# Altium schematic sheet TopLevel.SchDoc
size 508 x 304 mm; SheetNumber: 1; SheetTotal: 11
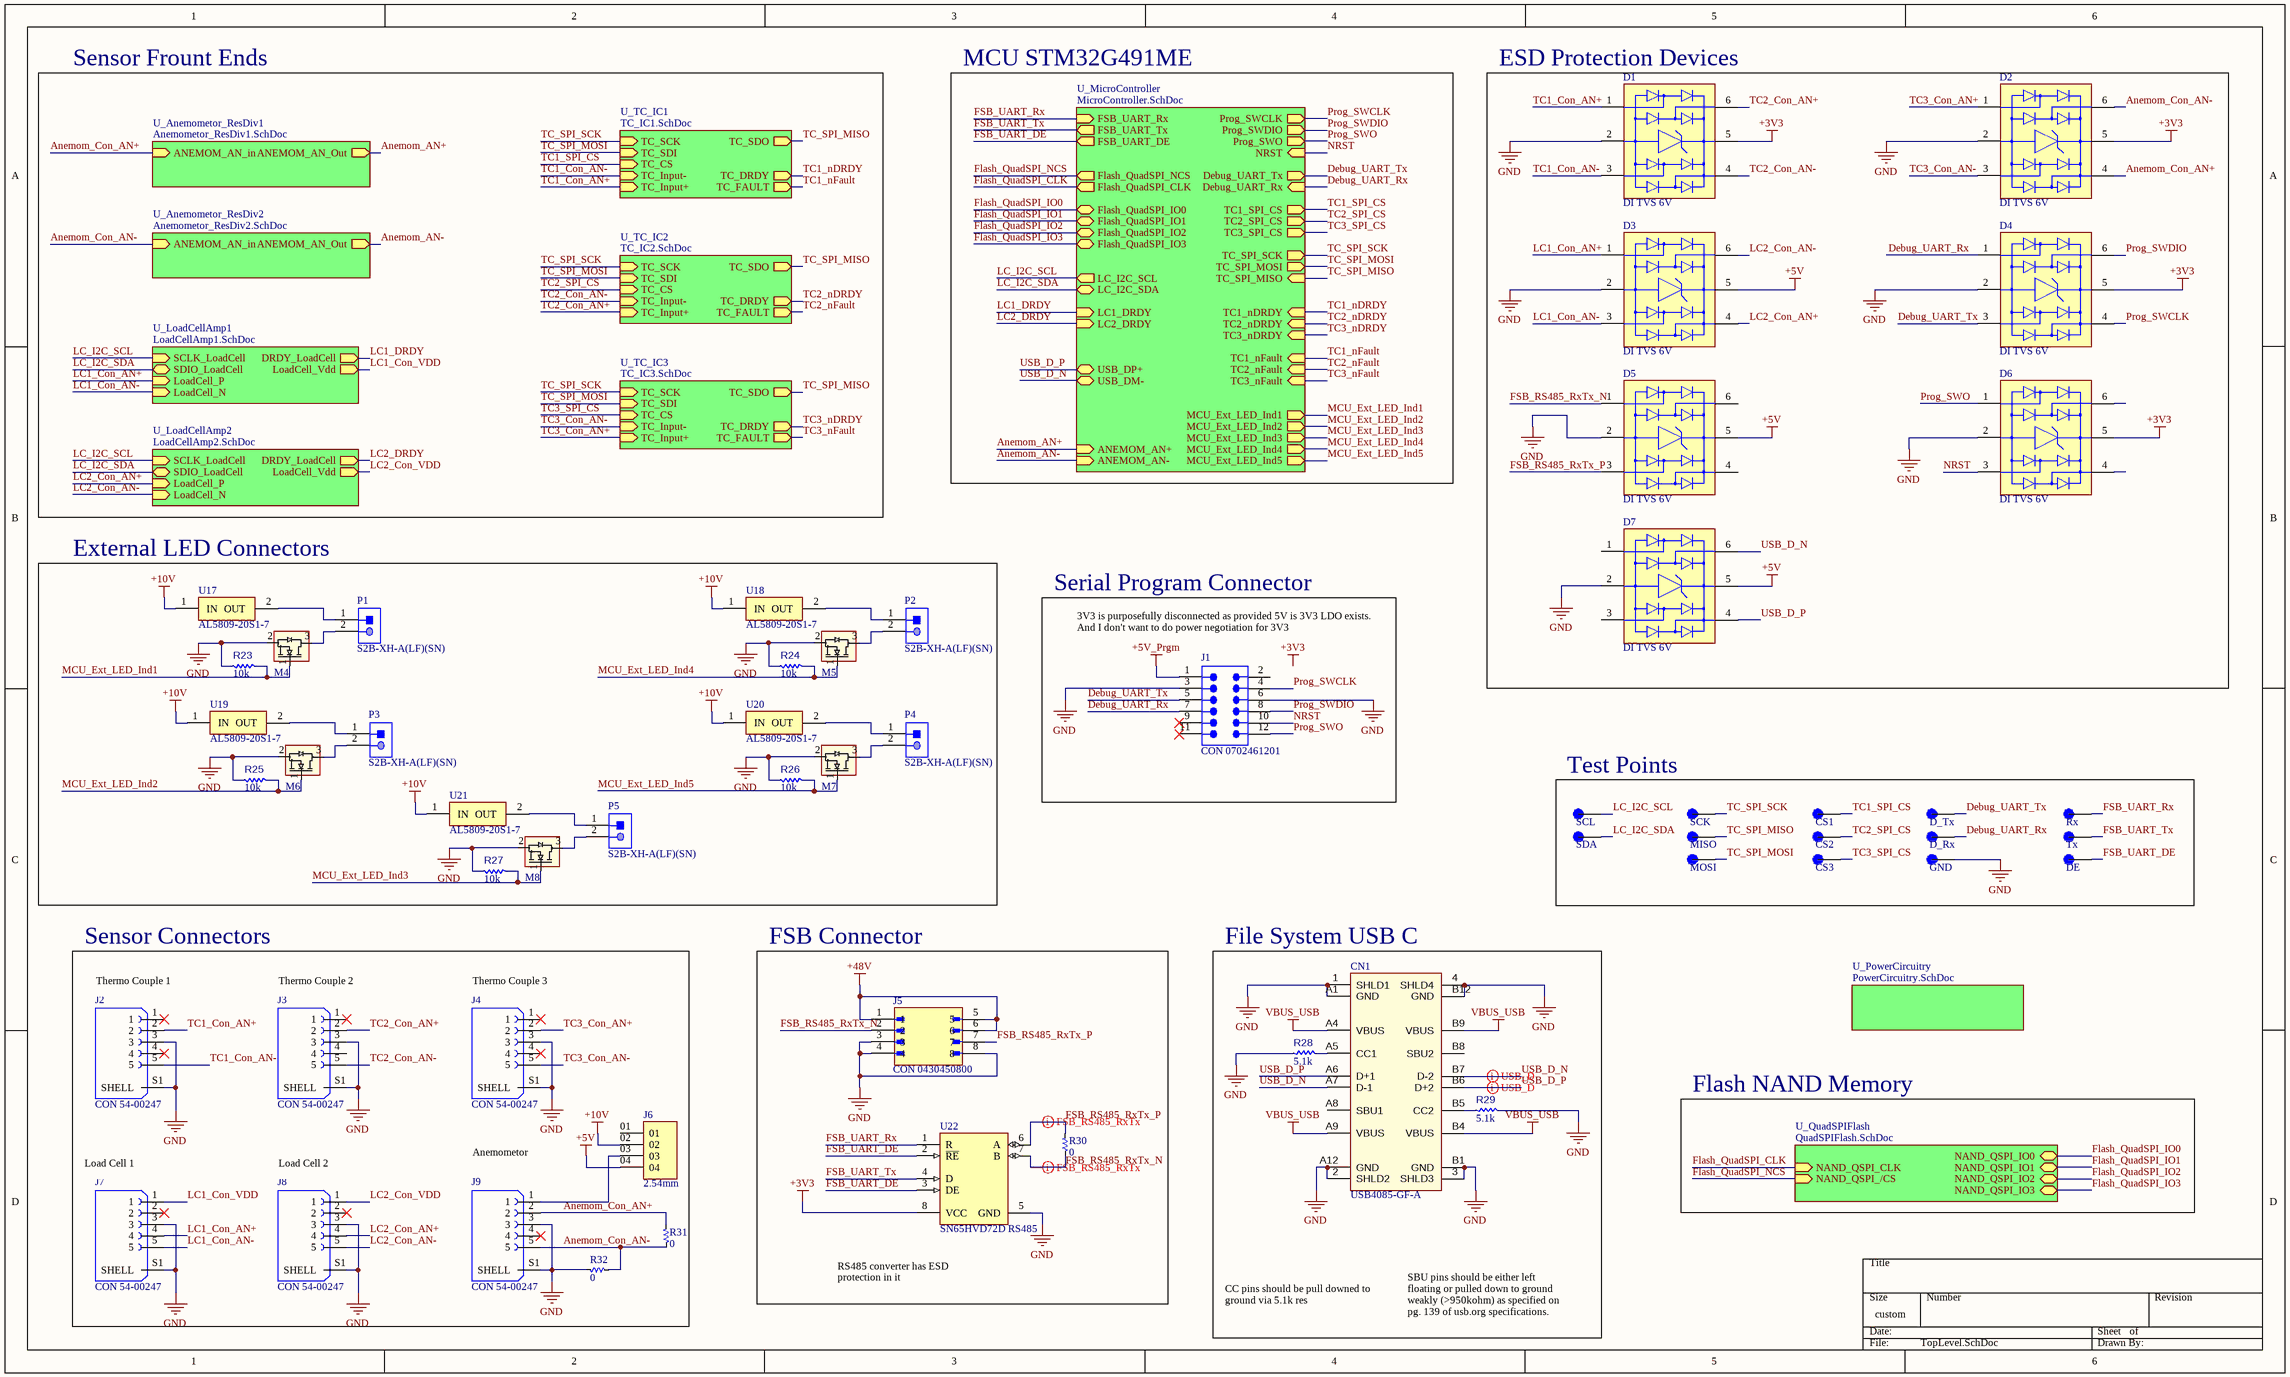
[diagram p0: TopLevel.SchDoc]

## Parts
CN1  USB4085-GF-A  [FP-USB4085-GF-A-MFG]
CS1  TP Clip 1206  RCWCTE  [1206 TP Clip RCWCTE-Footprint-1]  (value not drawn)
CS2  TP Clip 1206  RCWCTE  [1206 TP Clip RCWCTE-Footprint-1]  (value not drawn)
CS3  TP Clip 1206  RCWCTE  [1206 TP Clip RCWCTE-Footprint-1]  (value not drawn)
D1  DI TVS 6V  [FP-SOT363-IPC_C]
D2  DI TVS 6V  [FP-SOT363-IPC_C]
D3  DI TVS 6V  [FP-SOT363-IPC_C]
D4  DI TVS 6V  [FP-SOT363-IPC_C]
D5  DI TVS 6V  [FP-SOT363-IPC_C]
D6  DI TVS 6V  [FP-SOT363-IPC_C]
D7  DI TVS 6V  [FP-SOT363-IPC_C]
D_Rx  TP Clip 1206  RCWCTE  [1206 TP Clip RCWCTE-Footprint-1]  (value not drawn)
D_Tx  TP Clip 1206  RCWCTE  [1206 TP Clip RCWCTE-Footprint-1]  (value not drawn)
DE  TP Clip 1206  RCWCTE  [1206 TP Clip RCWCTE-Footprint-1]  (value not drawn)
GND  TP Clip 1206  RCWCTE  [1206 TP Clip RCWCTE-Footprint-1]  (value not drawn)
J1  CON 0702461201  [FP-70246-1201-0]
J2  CON 54-00247  [CON 54-00247-Footprint-1]
J3  CON 54-00247  [CON 54-00247-Footprint-1]
J4  CON 54-00247  [CON 54-00247-Footprint-1]
J5  CON 0430450800  [CON 0430450800-Footprint-1]
J6  2.54mm  [HEADER 4pos 2.54mm-Footprint-1]
J7  CON 54-00247  [CON 54-00247-Footprint-1]
J8  CON 54-00247  [CON 54-00247-Footprint-1]
J9  CON 54-00247  [CON 54-00247-Footprint-1]
M4  MOS NMOS 30V 5.6A SOT-23  [PJA3404_R1_00001-Footprint-1]  (value not drawn)
M5  MOS NMOS 30V 5.6A SOT-23  [PJA3404_R1_00001-Footprint-1]  (value not drawn)
M6  MOS NMOS 30V 5.6A SOT-23  [PJA3404_R1_00001-Footprint-1]  (value not drawn)
M7  MOS NMOS 30V 5.6A SOT-23  [PJA3404_R1_00001-Footprint-1]  (value not drawn)
M8  MOS NMOS 30V 5.6A SOT-23  [PJA3404_R1_00001-Footprint-1]  (value not drawn)
MISO  TP Clip 1206  RCWCTE  [1206 TP Clip RCWCTE-Footprint-1]  (value not drawn)
MOSI  TP Clip 1206  RCWCTE  [1206 TP Clip RCWCTE-Footprint-1]  (value not drawn)
P1  S2B-XH-A(LF)(SN)  [JST-S2B-XH-A(LF)(SN)_V]
P2  S2B-XH-A(LF)(SN)  [JST-S2B-XH-A(LF)(SN)_V]
P3  S2B-XH-A(LF)(SN)  [JST-S2B-XH-A(LF)(SN)_V]
P4  S2B-XH-A(LF)(SN)  [JST-S2B-XH-A(LF)(SN)_V]
P5  S2B-XH-A(LF)(SN)  [JST-S2B-XH-A(LF)(SN)_V]
R23  value 10k  [RESC2013X50X35ML15T15]  (hidden comment: Resistor 10k +/-1% 0805 125 mW)
R24  value 10k  [RESC2013X50X35ML15T15]  (hidden comment: Resistor 10k +/-1% 0805 125 mW)
R25  value 10k  [RESC2013X50X35ML15T15]  (hidden comment: Resistor 10k +/-1% 0805 125 mW)
R26  value 10k  [RESC2013X50X35ML15T15]  (hidden comment: Resistor 10k +/-1% 0805 125 mW)
R27  value 10k  [RESC2013X50X35ML15T15]  (hidden comment: Resistor 10k +/-1% 0805 125 mW)
R28  value 5.1k  [RESC1608X55X25ML10T15]  (hidden comment: RC0603FR-075K1L)
R29  value 5.1k  [RESC1608X55X25ML10T15]  (hidden comment: RC0603FR-075K1L)
R30  value 0  [0603]  (hidden comment: RT-0R00-F-1/10W-0603)
R31  value 0  [0603]  (hidden comment: RT-0R00-F-1/10W-0603)
R32  value 0  [0603]  (hidden comment: RT-0R00-F-1/10W-0603)
Rx  TP Clip 1206  RCWCTE  [1206 TP Clip RCWCTE-Footprint-1]  (value not drawn)
SCK  TP Clip 1206  RCWCTE  [1206 TP Clip RCWCTE-Footprint-1]  (value not drawn)
SCL  TP Clip 1206  RCWCTE  [1206 TP Clip RCWCTE-Footprint-1]  (value not drawn)
SDA  TP Clip 1206  RCWCTE  [1206 TP Clip RCWCTE-Footprint-1]  (value not drawn)
Tx  TP Clip 1206  RCWCTE  [1206 TP Clip RCWCTE-Footprint-1]  (value not drawn)
U17  AL5809-20S1-7  [DIOD-SOD123-A_V]
U18  AL5809-20S1-7  [DIOD-SOD123-A_V]
U19  AL5809-20S1-7  [DIOD-SOD123-A_V]
U20  AL5809-20S1-7  [DIOD-SOD123-A_V]
U21  AL5809-20S1-7  [DIOD-SOD123-A_V]
U22  SN65HVD72D RS485  [D0008A_L]

## Blocks framed on the sheet
ESD Protection Devices: D1-D7
External LED Connectors: M4-M8 P1-P5 R23-R27 U17-U21
Serial Program Connector: J1
Test Points: CS1-CS3 D_Rx D_Tx DE GND MISO MOSI Rx SCK SCL SDA Tx
Sensor Connectors: J2-J4 J6-J9 R31 R32
FSB Connector: J5 R30 U22
File System USB C: CN1 R28 R29

## Sub-sheets
U_Anemometor_ResDiv1 = Anemometor_ResDiv1.SchDoc: ANEMOM_AN_in (in), ANEMOM_AN_Out (out)
U_Anemometor_ResDiv2 = Anemometor_ResDiv2.SchDoc: ANEMOM_AN_in (in), ANEMOM_AN_Out (out)
U_LoadCellAmp1 = LoadCellAmp1.SchDoc: DRDY_LoadCell (out), SCLK_LoadCell (in), SDIO_LoadCell (bidir), LoadCell_P (in), LoadCell_N (in), LoadCell_Vdd (out)
U_LoadCellAmp2 = LoadCellAmp2.SchDoc: DRDY_LoadCell (out), SCLK_LoadCell (in), SDIO_LoadCell (bidir), LoadCell_P (in), LoadCell_N (in), LoadCell_Vdd (out)
U_MicroController = MicroController.SchDoc: NRST (in), FSB_UART_Tx (out), FSB_UART_Rx (in), Prog_SWCLK (out), Prog_SWDIO (out), Prog_SWO (out), FSB_UART_DE (out), Debug_UART_Tx (out), Debug_UART_Rx (in), Flash_QuadSPI_CLK (out), Flash_QuadSPI_NCS (out), Flash_QuadSPI_IO2 (bidir), Flash_QuadSPI_IO3 (bidir), Flash_QuadSPI_IO1 (bidir), Flash_QuadSPI_IO0 (bidir), TC_SPI_SCK (out), TC_SPI_MISO (in), TC_SPI_MOSI (out), TC1_SPI_CS (out), TC2_SPI_CS (out), TC3_SPI_CS (out), LC_I2C_SCL (out), LC_I2C_SDA (bidir), USB_DP+ (bidir), USB_DM- (bidir), ANEMOM_AN+ (in), ANEMOM_AN- (in), MCU_Ext_LED_Ind1 (out), MCU_Ext_LED_Ind2 (out), MCU_Ext_LED_Ind3 (out), MCU_Ext_LED_Ind4 (out), MCU_Ext_LED_Ind5 (out), TC3_nDRDY (in), TC2_nDRDY (in), TC1_nDRDY (in), TC3_nFault (in), TC2_nFault (in), TC1_nFault (in), LC1_DRDY (in), LC2_DRDY (in)
U_PowerCircuitry = PowerCircuitry.SchDoc: no entries
U_QuadSPIFlash = QuadSPIFlash.SchDoc: NAND_QSPI_/CS (in), NAND_QSPI_IO1 (bidir), NAND_QSPI_IO2 (bidir), NAND_QSPI_IO3 (bidir), NAND_QSPI_CLK (in), NAND_QSPI_IO0 (bidir)
U_TC_IC1 = TC_IC1.SchDoc: TC_SCK (in), TC_SDI (in), TC_SDO (out), TC_CS (in), TC_Input- (in), TC_Input+ (in), TC_DRDY (out), TC_FAULT (out)
U_TC_IC2 = TC_IC2.SchDoc: TC_SCK (in), TC_SDI (in), TC_SDO (out), TC_CS (in), TC_Input- (in), TC_Input+ (in), TC_DRDY (out), TC_FAULT (out)
U_TC_IC3 = TC_IC3.SchDoc: TC_SCK (in), TC_SDI (in), TC_SDO (out), TC_CS (in), TC_Input- (in), TC_Input+ (in), TC_DRDY (out), TC_FAULT (out)

## Nets
+3V3: D1.5(VP) D2.5(VP) D4.5(VP) D6.5(VP) U22.8(VCC)
+5V: D3.5(VP) D5.5(VP) D7.5(VP) J6.04
+5V_Prgm: J1.1
+10V: J6.02 U17.1(IN) U18.1(IN) U19.1(IN) U20.1(IN) U21.1(IN)
+48V: J5.1 J5.5 J5.6
GND: CN1.1(SHLD1) CN1.2(SHLD2) CN1.3(SHLD3) CN1.4(SHLD4) CN1.A1(GND) CN1.A12(GND) CN1.B1(GND) CN1.B12(GND) D1.2(VN) D2.2(VN) D3.2(VN) D4.2(VN) D5.2(VN) D6.2(VN) D7.2(VN) GND.1(TP) J1.3 J1.6 J2.3 J2.S1(SHELL) J3.3 J3.S1(SHELL) J4.3 J4.S1(SHELL) J5.3 J5.4 J5.8 J7.3 J7.S1(SHELL) J8.3 J8.S1(SHELL) J9.3 J9.S1(SHELL) M4.2 M5.2 M6.2 M7.2 M8.2 R23.2 R24.2 R25.2 R26.2 R27.2 R28.1 R29.2 R32.1 U22.5(GND)
VBUS_USB: CN1.A4(VBUS) CN1.A9(VBUS) CN1.B4(VBUS) CN1.B9(VBUS)
Anemom_AN+: sheet U_MicroController/ANEMOM_AN+, sheet U_Anemometor_ResDiv1/ANEMOM_AN_Out
Anemom_AN-: sheet U_MicroController/ANEMOM_AN-, sheet U_Anemometor_ResDiv2/ANEMOM_AN_Out
Anemom_Con_AN+: D2.4(CH3) J9.2 R31.2 ; sheet U_Anemometor_ResDiv1/ANEMOM_AN_in
Anemom_Con_AN-: D2.6(CH4) J9.5 R31.1 R32.2 ; sheet U_Anemometor_ResDiv2/ANEMOM_AN_in
Debug_UART_Rx: D4.1(CH1) D_Rx.1(TP) J1.7 ; sheet U_MicroController/Debug_UART_Rx
Debug_UART_Tx: D4.3(CH2) D_Tx.1(TP) J1.5 ; sheet U_MicroController/Debug_UART_Tx
Flash_QuadSPI_CLK: sheet U_MicroController/Flash_QuadSPI_CLK, sheet U_QuadSPIFlash/NAND_QSPI_CLK
Flash_QuadSPI_IO0: sheet U_MicroController/Flash_QuadSPI_IO0, sheet U_QuadSPIFlash/NAND_QSPI_IO0
Flash_QuadSPI_IO1: sheet U_MicroController/Flash_QuadSPI_IO1, sheet U_QuadSPIFlash/NAND_QSPI_IO1
Flash_QuadSPI_IO2: sheet U_MicroController/Flash_QuadSPI_IO2, sheet U_QuadSPIFlash/NAND_QSPI_IO2
Flash_QuadSPI_IO3: sheet U_MicroController/Flash_QuadSPI_IO3, sheet U_QuadSPIFlash/NAND_QSPI_IO3
Flash_QuadSPI_NCS: sheet U_MicroController/Flash_QuadSPI_NCS, sheet U_QuadSPIFlash/NAND_QSPI_/CS
FSB_RS485_RxTx_N: D5.1(CH1) J5.2 R30.1 U22.7(B)
FSB_RS485_RxTx_P: D5.3(CH2) J5.7 R30.2 U22.6(A)
FSB_UART_DE: DE.1(TP) U22.2(~{RE}) U22.3(DE) ; sheet U_MicroController/FSB_UART_DE
FSB_UART_Rx: Rx.1(TP) U22.1(R) ; sheet U_MicroController/FSB_UART_Rx
FSB_UART_Tx: Tx.1(TP) U22.4(D) ; sheet U_MicroController/FSB_UART_Tx
LC1_Con_AN+: D3.1(CH1) J7.4 ; sheet U_LoadCellAmp1/LoadCell_P
LC1_Con_AN-: D3.3(CH2) J7.5 ; sheet U_LoadCellAmp1/LoadCell_N
LC1_Con_VDD: J7.1 ; sheet U_LoadCellAmp1/LoadCell_Vdd
LC1_DRDY: sheet U_MicroController/LC1_DRDY, sheet U_LoadCellAmp1/DRDY_LoadCell
LC2_Con_AN+: D3.4(CH3) J8.4 ; sheet U_LoadCellAmp2/LoadCell_P
LC2_Con_AN-: D3.6(CH4) J8.5 ; sheet U_LoadCellAmp2/LoadCell_N
LC2_Con_VDD: J8.1 ; sheet U_LoadCellAmp2/LoadCell_Vdd
LC2_DRDY: sheet U_MicroController/LC2_DRDY, sheet U_LoadCellAmp2/DRDY_LoadCell
LC_I2C_SCL: SCL.1(TP) ; sheet U_MicroController/LC_I2C_SCL, sheet U_LoadCellAmp1/SCLK_LoadCell, sheet U_LoadCellAmp2/SCLK_LoadCell
LC_I2C_SDA: SDA.1(TP) ; sheet U_MicroController/LC_I2C_SDA, sheet U_LoadCellAmp1/SDIO_LoadCell, sheet U_LoadCellAmp2/SDIO_LoadCell
MCU_Ext_LED_Ind1: M4.1 R23.1 ; sheet U_MicroController/MCU_Ext_LED_Ind1
MCU_Ext_LED_Ind2: M6.1 R25.1 ; sheet U_MicroController/MCU_Ext_LED_Ind2
MCU_Ext_LED_Ind3: M8.1 R27.1 ; sheet U_MicroController/MCU_Ext_LED_Ind3
MCU_Ext_LED_Ind4: M5.1 R24.1 ; sheet U_MicroController/MCU_Ext_LED_Ind4
MCU_Ext_LED_Ind5: M7.1 R26.1 ; sheet U_MicroController/MCU_Ext_LED_Ind5
NRST: D6.3(CH2) J1.10 ; sheet U_MicroController/NRST
Prog_SWCLK: D4.4(CH3) J1.4 ; sheet U_MicroController/Prog_SWCLK
Prog_SWDIO: D4.6(CH4) J1.8 ; sheet U_MicroController/Prog_SWDIO
Prog_SWO: D6.1(CH1) J1.12 ; sheet U_MicroController/Prog_SWO
TC1_Con_AN+: D1.1(CH1) J2.2 ; sheet U_TC_IC1/TC_Input+
TC1_Con_AN-: D1.3(CH2) J2.5 ; sheet U_TC_IC1/TC_Input-
TC1_nDRDY: sheet U_MicroController/TC1_nDRDY, sheet U_TC_IC1/TC_DRDY
TC1_nFault: sheet U_MicroController/TC1_nFault, sheet U_TC_IC1/TC_FAULT
TC1_SPI_CS: CS1.1(TP) ; sheet U_MicroController/TC1_SPI_CS, sheet U_TC_IC1/TC_CS
TC2_Con_AN+: D1.6(CH4) J3.2 ; sheet U_TC_IC2/TC_Input+
TC2_Con_AN-: D1.4(CH3) J3.5 ; sheet U_TC_IC2/TC_Input-
TC2_nDRDY: sheet U_MicroController/TC2_nDRDY, sheet U_TC_IC2/TC_DRDY
TC2_nFault: sheet U_MicroController/TC2_nFault, sheet U_TC_IC2/TC_FAULT
TC2_SPI_CS: CS2.1(TP) ; sheet U_MicroController/TC2_SPI_CS, sheet U_TC_IC2/TC_CS
TC3_Con_AN+: D2.1(CH1) J4.2 ; sheet U_TC_IC3/TC_Input+
TC3_Con_AN-: D2.3(CH2) J4.5 ; sheet U_TC_IC3/TC_Input-
TC3_nDRDY: sheet U_MicroController/TC3_nDRDY, sheet U_TC_IC3/TC_DRDY
TC3_nFault: sheet U_MicroController/TC3_nFault, sheet U_TC_IC3/TC_FAULT
TC3_SPI_CS: CS3.1(TP) ; sheet U_MicroController/TC3_SPI_CS, sheet U_TC_IC3/TC_CS
TC_SPI_MISO: MISO.1(TP) ; sheet U_MicroController/TC_SPI_MISO, sheet U_TC_IC1/TC_SDO, sheet U_TC_IC2/TC_SDO, sheet U_TC_IC3/TC_SDO
TC_SPI_MOSI: MOSI.1(TP) ; sheet U_MicroController/TC_SPI_MOSI, sheet U_TC_IC1/TC_SDI, sheet U_TC_IC2/TC_SDI, sheet U_TC_IC3/TC_SDI
TC_SPI_SCK: SCK.1(TP) ; sheet U_MicroController/TC_SPI_SCK, sheet U_TC_IC1/TC_SCK, sheet U_TC_IC2/TC_SCK, sheet U_TC_IC3/TC_SCK
USB_D_N: CN1.A7(D-1) CN1.B7(D-2) D7.6(CH4) ; sheet U_MicroController/USB_DM-
USB_D_P: CN1.A6(D+1) CN1.B6(D+2) D7.4(CH3) ; sheet U_MicroController/USB_DP+
NetCN1_A5: CN1.A5(CC1) R28.2
NetCN1_B5: CN1.B5(CC2) R29.1
NetJ6_03: J6.03 J9.1
NetM4_3: M4.3 P1.2
NetM5_3: M5.3 P2.2
NetM6_3: M6.3 P3.2
NetM7_3: M7.3 P4.2
NetM8_3: M8.3 P5.2
NetP1_1: P1.1 U17.2(OUT)
NetP2_1: P2.1 U18.2(OUT)
NetP3_1: P3.1 U19.2(OUT)
NetP4_1: P4.1 U20.2(OUT)
NetP5_1: P5.1 U21.2(OUT)

Not connected (* = marked no-connect by the designer): CN1 A8(SBU1) B8(SBU2); D5 4(CH3) 6(CH4); D6 4(CH3) 6(CH4); D7 1(CH1) 3(CH2); J1 2 9* 11*; J2 1* 4*; J3 1* 4; J4 1* 4*; J6 01; J7 2*; J8 2*; J9 4*

## Layout directives
differential pair: FSB_RS485_RxTx_N, FSB_RS485_RxTx_P, USB_D_N, USB_D_P

## Notes on the sheet
- Sensor Frount Ends
- MCU STM32G491ME
- (near J1) 3V3 is purposefully disconnected as provided 5V is 3V3 LDO exists. And I don't want to do power negotiation for 3V3
- (near J2) Thermo Couple 1
- (near J3) Thermo Couple 2
- (near J4) Thermo Couple 3
- Flash NAND Memory
- (near J9) Anemometor
- (near J7) Load Cell 1
- (near J8) Load Cell 2
- RS485 converter has ESD protection in it
- CC pins should be pull downed to ground via 5.1k res
- SBU pins should be either left floating or pulled down to ground weakly (>950kohm) as specified on pg. 139 of usb.org specifications.
- Labels drawn without touching a wire or pin: +3V3

## Library data of the parts
CN1 = CMP-002-00138-4: USB Connector, 16 Contact(s), Female, Right Angle, Solder Terminal, Locking, Receptacle; Voltage Rating: 20V; Gender: Receptacle; Pins: 16; Max Operating Temperature: 85°C; Min Operating Temperature: -40°C
CS1-CS3 D_Rx D_Tx DE GND MISO MOSI Rx SCK SCL SDA Tx = CMP-002-00130-3: PC TEST POINT 1206 footprint RCWCTE
D1-D7 = CMP-004-00069-1: ESD Suppressors / TVS Diodes 4 Ch TVS Diode Array 3.3V 6.0A 200mW; Max Surge Current: 5A; Pins: 6; Max Operating Temperature: 150°C; Min Operating Temperature: -55°C; Case/Package: SOT-363; Mounting Technology: Surface Mount
J1 = CMP-002-00120-1: Conn Shrouded Header (4 Sides) HDR 12 POS 2.54mm Solder ST Top Entry Thru-Hole C-Grid® Tray; Connector Type: Male Pin; Gender: Male; Voltage Rating: 250V; Max Operating Temperature: 120°C; Min Operating Temperature: -55°C; Pins: 12; Mounting Technology: Through Hole
J2-J4 J7-J9 = CMP-002-00123-1: Circular Connector, 5 Contact(s), Brass, Female, Solder Terminal, Socket; Min Operating Temperature: -40°C; Pins: 5; Max Operating Temperature: 105°C
J5 = CMP-002-00126-1: 0430450800 Connector Header Through Hole, Right Angle 8 position 0.118" (3.00mm)
J6 = CMP-002-00139-2: TS-104-G-AA; Max Current Rating: 1A; Gender: Male; Min Operating Temperature: -55°C; Mounting Technology: Through Hole; Max Operating Temperature: 125°C
M4-M8 = CMP-013-00040-2: PJA3404_R1_00001 - Power Field-Effect Transistor, 5.6A I(D), 30V, 0.03ohm, 1-Element, N-Channel, Silicon, Metal-oxide Semiconductor FET; Transistor Application: SWITCHING; Drain-source On Resistance-Max: 30mR; Pulsed Drain Current-Max (IDM): 22A; Package Body Material: Plastic; Operating Mode: ENHANCEMENT MODE; Number of Elements: 1; Drain Current-Max (ID): 5.6A; DS Breakdown Voltage-Min: 30V; Transistor Element Material: SILICON; Polarity/Channel Type: N-CHANNEL; Surface Mount: Yes; Package Shape: Rectangular; Package Style: SMALL OUTLINEMeter; FET Technology: METAL-OXIDE SEMICONDUCTOR; Pins: 3; JESD-30 Code: R-PDSO-G3; Terminal Position: DUAL; RoHS Compliant: Yes; Reach SVHC Compliant: Yes; Terminal Form: Gull Wing
P1-P5 = CMP-002-00032-2: Male Header, Pitch 2.5 mm, 1 x 2 Position, Height 6.1 mm, Tail Length 3.4 mm, -25 to 85 degC, RoHS, Bulk; Manufacturer: JST; Case/Package: S2B-XH-A(LF)(SN); Package Description: XH Series Disconnectable Crimp Style Connector, Pitch 2.5 mm, 1 x 2 Position, Height 6.1 mm, Tail Length 3.4 mm; Manufacturer URL: http://www.jst.com/home2.html; Datasheet URL: http://www.jst-mfg.com/product/pdf/eng/eXH.pdf; Connector Type: Header; Package Reference: S2B-XH-A(LF)(SN); Mounting Technology: TH; Max Operating Temperature: 85°C; Min Operating Temperature: -25°C; Datasheet Version: May-16; Gender: Male; RoHS Compliant: Unknown
R23-R27 = CMP-009-00018-9: Chip Resistor, 10 KOhm, +/- 1%, 125 mW, -55 to 155 degC, 0805 (2012 Metric); Power: 125mW; Voltage Rating: 150V; Tolerance: 1%; RoHS Compliant: True; Pins: 2; Case/Package: 0805; Mounting Technology: SM; Min Operating Temperature: -55°C; Max Operating Temperature: 155°C
R28 R29 = CMP-009-00261-1: Fixed Resistor, Metal Glaze/thick Film, 0.1W, 5100ohm, 75V, 1% +/-Tol, 100ppm/Cel, Surface Mount, 0603; Power: 100mW; Max Operating Temperature: 155°C; Case/Package: 0603; Mounting Technology: Surface Mount; Pins: 2; Min Operating Temperature: -55°C; Tolerance: 1%; RoHS Compliant: Yes
R30-R32 = CMP-009-00192-1: 0 Ohms Jumper 0.1W, 1/10W Chip Resistor 0603 (1608 Metric) Automotive AEC-Q200 Thick Film; Manufacturer Part #: RMCF0603ZT0R00; Manufacturer: Stackpole Electronics Inc; ComponentLink1URL: https://industrial.panasonic.com/ww/products/resistors/chip-resistors/general-purpose-chip-resistors/models/ERJ2GE0R00X; Part Description: 0 Ohms Jumper 0.1W, 1/10W Chip Resistor 0603 (1608 Metric) Automotive AEC-Q200 Thick Film; ComponentLink2URL: https://industrial.panasonic.com/ww/products/resistors/chip-resistors/general-purpose-chip-resistors/models/ERJ2GE0R00X; Design Item ID: RT-0R00-F-1/10W-0603; Source: PlumBay_SchLib.SchLib; Distributor Part #: RMCF0603ZT0R00CT-ND; ComponentLink1Description: Datasheet; ComponentLink2Description: Manufacturer Website; Distributor: Digikey
U17-U21 = CMP-00024-00007-1: Led Driver, Cc/Linear, -40 To 125Deg C Rohs Compliant: Yes; Min Input Voltage: 2.5V; Max Output current: 21mA; Max Supply Voltage: 60V; Mounting Technology: Surface Mount; Max Operating Temperature: 125°C; Pins: 2; Min Operating Temperature: -40°C; Case/Package: SOD
U22 = CMP-015-00012-1: Line Transceiver, 1 Func, 1 Driver, 1 Rcvr, PDSO8; Nominal Supply Voltage: 3.3V; Min Supply Voltage: 3V; Max Supply Voltage: 3.6V; Max Operating Temperature: 125°C; Min Operating Temperature: -40°C; Pins: 8; RoHS Compliant: Yes; Case/Package: SOP